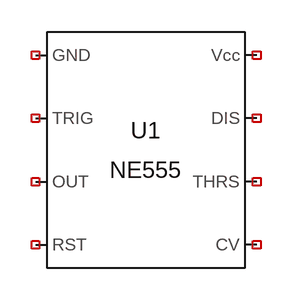
[diagram p0: schematic Draft1.asc]
Draft1.asc, the LTspice schematic file:
Version 4
SHEET 1 880 680
SYMBOL Misc\\NE555 224 176 R0
SYMATTR InstName U1

The netlist it stands for:
* Draft1.asc
XU1 NC_01 NC_02 NC_03 NC_04 NC_05 NC_06 NC_07 NC_08 NE555  ; pins GND TRIG OUT RST CV THRS DIS Vcc
.lib NE555.sub
.backanno
.end